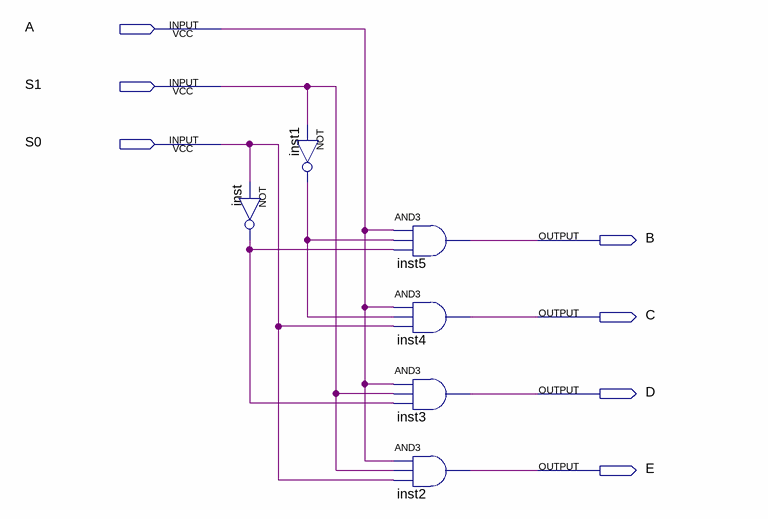
[diagram p0: schematic sheet]
// Quartus schematic DeMultiplexer.bdf as structural Verilog: 6 symbols, 7 pins
module DeMultiplexer (
  input  A,
  input  S1,
  input  S0,
  output B,
  output C,
  output D,
  output E
);

  wire inst1_out, inst_out;

  not inst (inst_out, S0);
  not inst1 (inst1_out, S1);
  and inst5 (B, A, inst1_out, inst_out);
  and inst4 (C, A, inst1_out, S0);
  and inst3 (D, A, S1, inst_out);
  and inst2 (E, A, S1, S0);
endmodule
